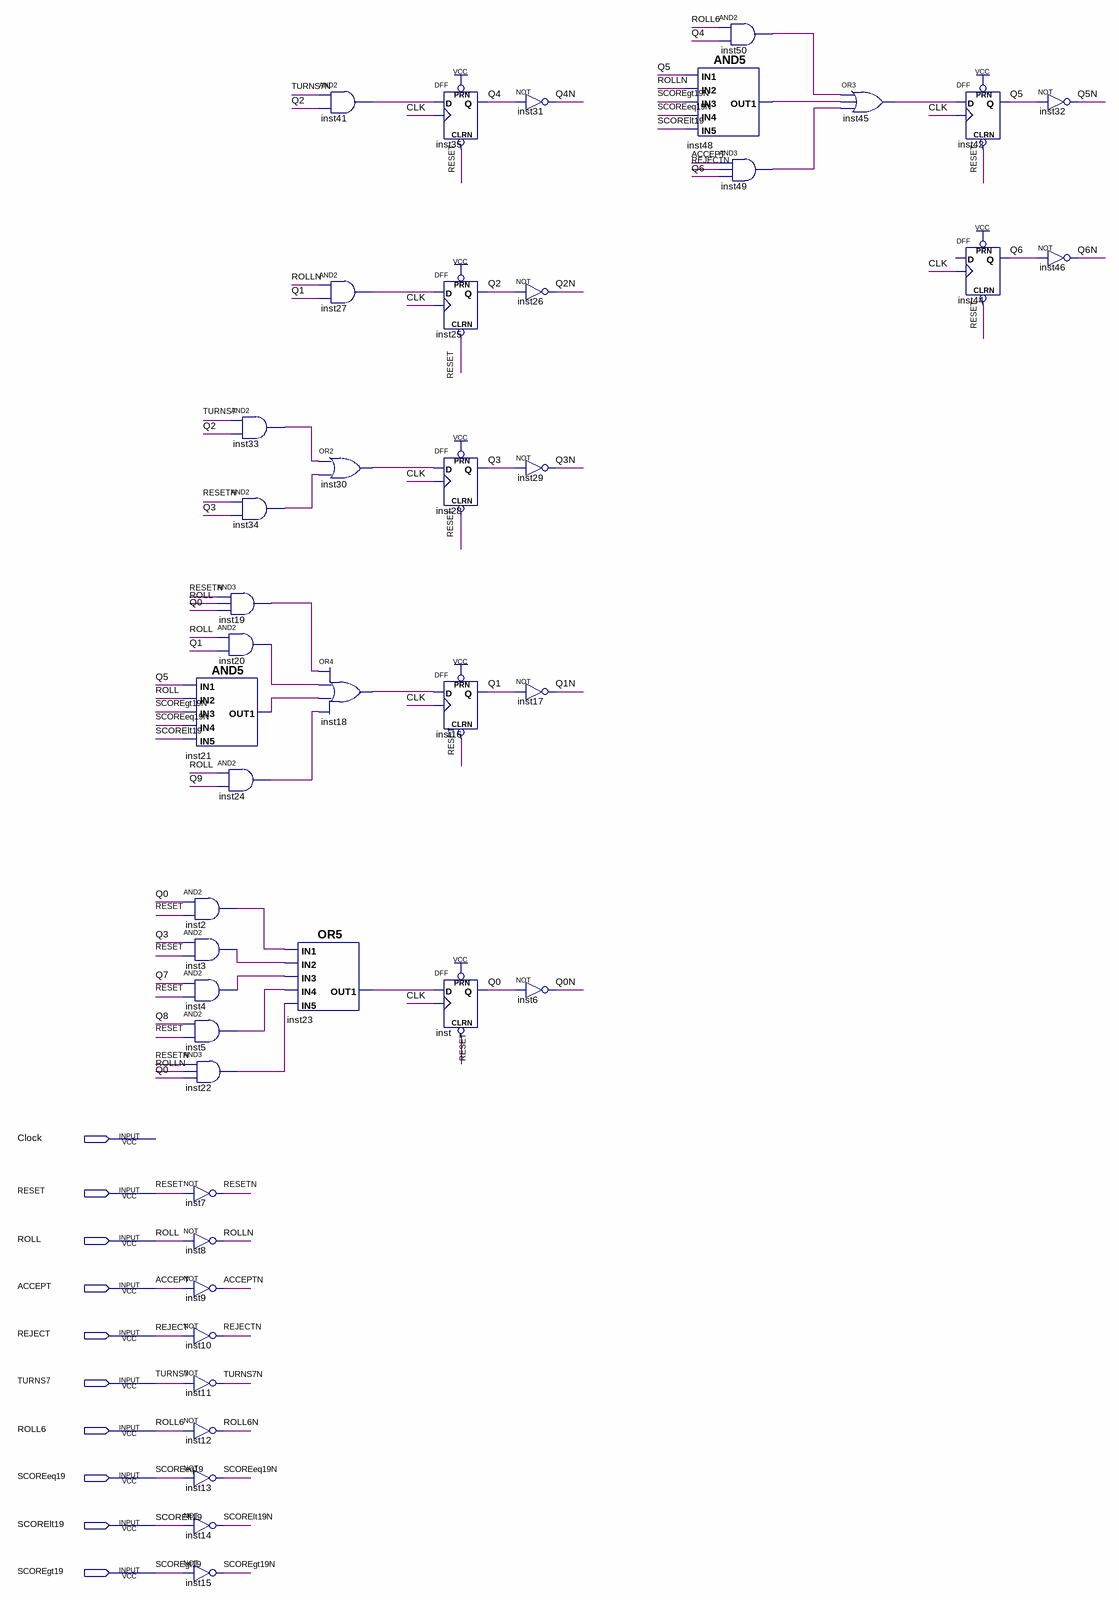
[diagram p0: schematic sheet]
// Quartus schematic ControlLogic.bdf as structural Verilog: 43 symbols, 10 pins
module ControlLogic (
  input  Clock,
  input  RESET,
  input  ROLL,
  input  ACCEPT,
  input  REJECT,
  input  TURNS7,
  input  ROLL6,
  input  SCOREeq19,
  input  SCORElt19,
  input  SCOREgt19
);

  wire ACCEPTN, CLK, inst2_out, inst3_out, inst4_out, inst5_out, inst18_out, inst19_out, inst20_out,
       inst21_out1, inst22_out, inst23_out1, inst24_out, inst27_out, inst30_out, inst33_out, inst34_out,
       inst41_out, inst45_out, inst48_out1, inst49_out, inst50_out, Q0, Q0N, Q1, Q1N, Q2, Q2N, Q3, Q3N, Q4,
       Q4N, Q5, Q5N, Q6, Q6N, Q7, Q8, Q9, REJECTN, RESETN, ROLL6N, ROLLN, SCOREeq19N, SCOREgt19N, SCORElt19N,
       TURNS7N;

  AND5 inst21 (.IN3(SCOREgt19N), .IN2(ROLL), .IN1(Q5), .IN5(SCORElt19), .IN4(SCOREeq19N), .OUT1(inst21_out1));
  and inst2 (inst2_out, Q0, RESET);
  and inst3 (inst3_out, Q3, RESET);
  and inst4 (inst4_out, Q7, RESET);
  and inst5 (inst5_out, Q8, RESET);
  and inst22 (inst22_out, RESETN, ROLLN, Q0);
  not inst7 (RESETN, RESET);
  not inst8 (ROLLN, ROLL);
  not inst9 (ACCEPTN, ACCEPT);
  not inst10 (REJECTN, REJECT);
  not inst11 (TURNS7N, TURNS7);
  not inst12 (ROLL6N, ROLL6);
  not inst13 (SCOREeq19N, SCOREeq19);
  not inst14 (SCORElt19N, SCORElt19);
  not inst15 (SCOREgt19N, SCOREgt19);
  and inst33 (inst33_out, TURNS7, Q2);
  and inst34 (inst34_out, RESETN, Q3);
  and inst19 (inst19_out, RESETN, ROLL, Q0);
  and inst20 (inst20_out, ROLL, Q1);
  and inst24 (inst24_out, ROLL, Q9);
  OR5 inst23 (.IN1(inst2_out), .IN3(inst4_out), .IN2(inst3_out), .IN5(inst22_out), .IN4(inst5_out), .OUT1(inst23_out1));
  and inst41 (inst41_out, TURNS7N, Q2);
  and inst27 (inst27_out, ROLLN, Q1);
  or inst30 (inst30_out, inst33_out, inst34_out);
  or inst18 (inst18_out, inst19_out, inst20_out, inst21_out1, inst24_out);
  DFF inst35 (.CLRN(RESET), .CLK(CLK), .D(inst41_out), .PRN(1'b1), .Q(Q4));
  DFF inst25 (.CLRN(RESET), .CLK(CLK), .D(inst27_out), .PRN(1'b1), .Q(Q2));
  DFF inst28 (.CLRN(RESET), .CLK(CLK), .D(inst30_out), .PRN(1'b1), .Q(Q3));
  DFF inst16 (.CLRN(RESET), .CLK(CLK), .D(inst18_out), .PRN(1'b1), .Q(Q1));
  DFF inst (.CLRN(RESET), .CLK(CLK), .D(inst23_out1), .PRN(1'b1), .Q(Q0));
  not inst31 (Q4N, Q4);
  not inst26 (Q2N, Q2);
  not inst29 (Q3N, Q3);
  not inst17 (Q1N, Q1);
  not inst6 (Q0N, Q0);
  and inst50 (inst50_out, ROLL6, Q4);
  AND5 inst48 (.IN3(SCOREgt19N), .IN2(ROLLN), .IN1(Q5), .IN5(SCORElt19), .IN4(SCOREeq19N), .OUT1(inst48_out1));
  and inst49 (inst49_out, ACCEPT, REJECTN, Q6);
  or inst45 (inst45_out, inst50_out, inst48_out1, inst49_out);
  DFF inst42 (.CLRN(RESET), .CLK(CLK), .D(inst45_out), .PRN(1'b1), .Q(Q5));
  DFF inst44 (.CLRN(RESET), .CLK(CLK), .PRN(1'b1), .Q(Q6));  // open: D
  not inst32 (Q5N, Q5);
  not inst46 (Q6N, Q6);
endmodule
